# EAGLE schematic 2023 (EAGLE 9.6.2)
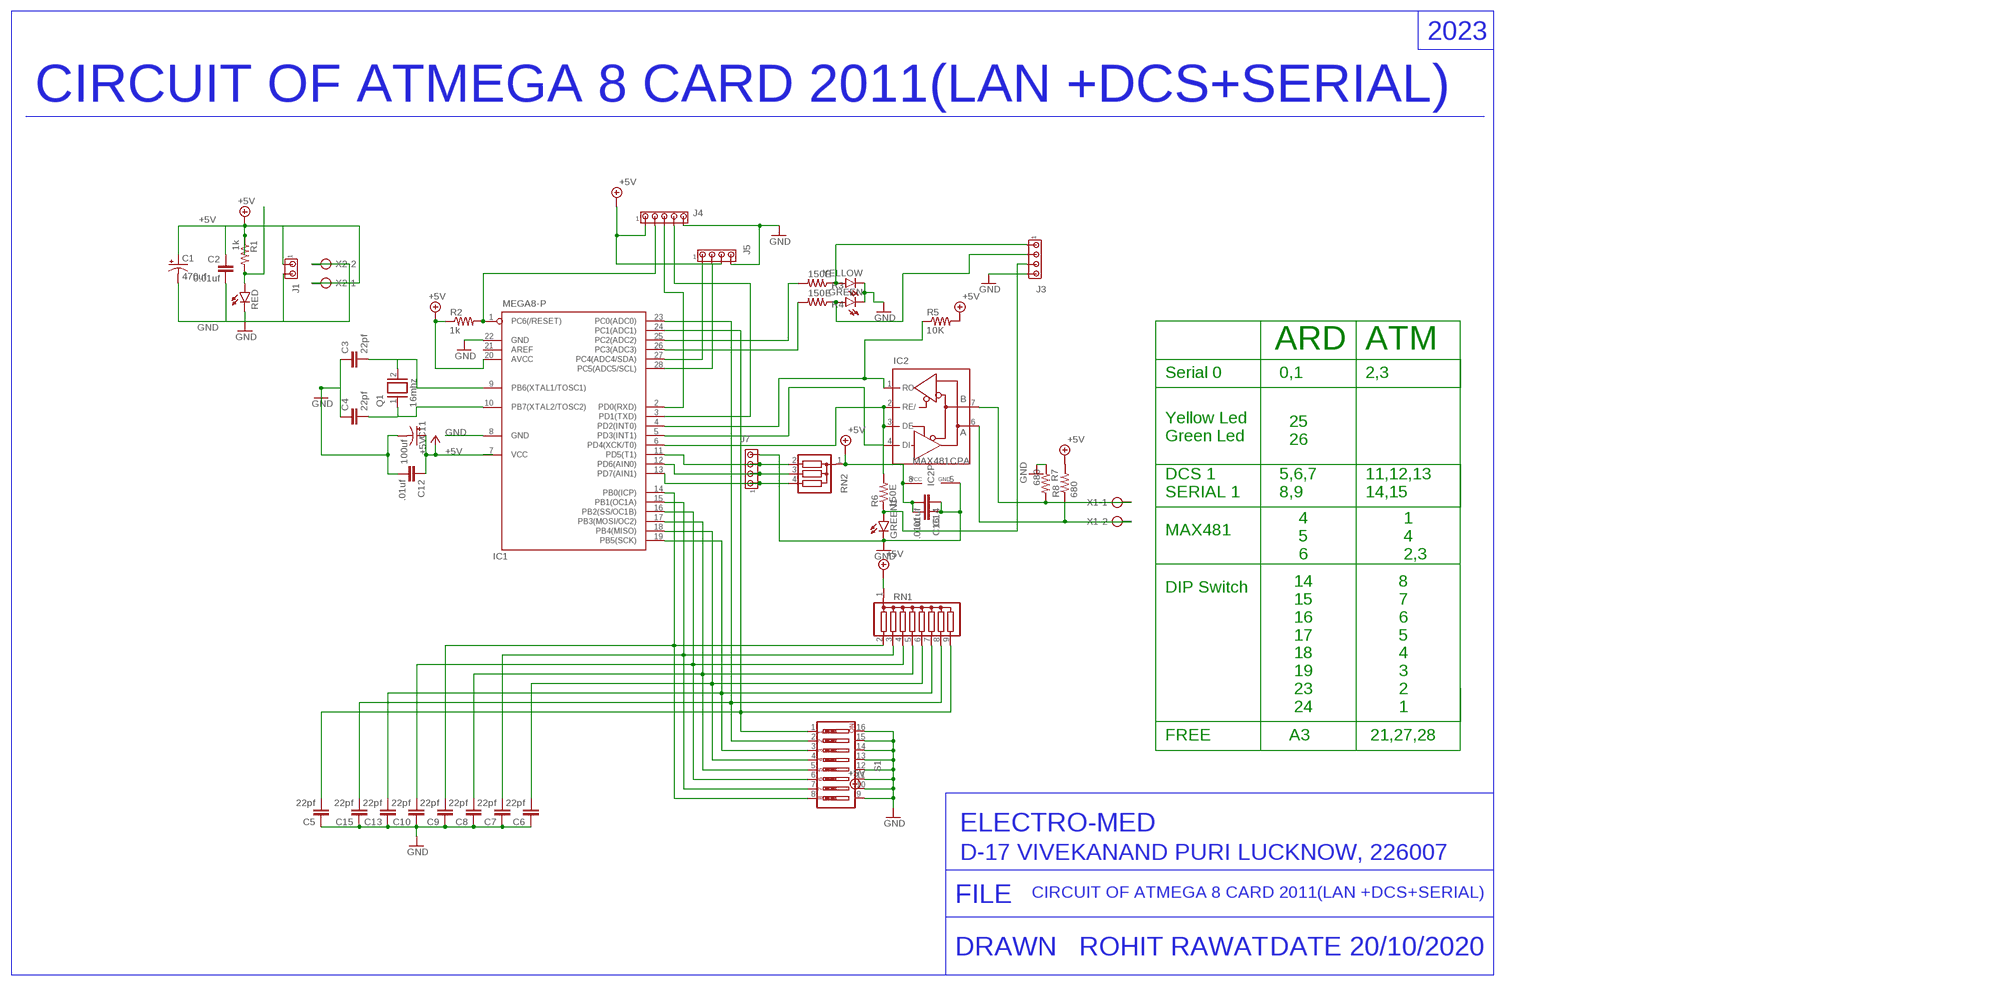
[diagram p0: schematic, sheet 1]

## Parts
C1  470uf  CPOL-USE5-10.5  [E5-10,5]
C2  0.01uf  C-EU-2050-030X075  [C050-030X075]
C3  22pf  C-EU-2050-030X075  [C050-030X075]
C4  22pf  C-EU-2050-030X075  [C050-030X075]
C5  22pf  C-EU-2050-030X075  [C050-030X075]
C6  22pf  C-EU-2050-030X075  [C050-030X075]
C7  22pf  C-EU-2050-030X075  [C050-030X075]
C8  22pf  C-EU-2050-030X075  [C050-030X075]
C9  22pf  C-EU-2050-030X075  [C050-030X075]
C10  22pf  C-EU-2050-030X075  [C050-030X075]
C11  100uf  CPOL-USE5-8.5  [E5-8,5]
C12  .01uf  C-EU050-025X075  [C050-025X075]
C13  22pf  C-EU-2050-030X075  [C050-030X075]
C14  .01uf  C-EU050-025X075  [C050-025X075]
C15  22pf  C-EU-2050-030X075  [C050-030X075]
C16  .01uf  C-EU050-025X075  [C050-025X075]
GREEN  LED5MM  [LED5MM]
GREEN1  LED5MM  [LED5MM]
IC1  MEGA8-P  [DIL28-3]
IC2  MAX481CPA  [DIL08]
J1  MTA02-100  [10X02MTA]
J3  MTA04-100  [10X04MTA]
J4  MTA05-100  [10X05MTA]
J5  MTA04-100  [10X04MTA]
J7  MTA04-100  [10X04MTA]
Q1  16mhz  XTAL/S  [QS]
R1  1k  R-US_0207/10  [0207/10]
R2  1k  R-US_0207/10  [0207/10]
R3  150E  R-US_0207/10  [0207/10]
R4  150E  R-US_0207/10  [0207/10]
R5  10K  R-US_0207/10  [0207/10]
R6  150E  R-US_0207/10  [0207/10]
R7  680  R-US_0207/10  [0207/10]
R8  680  R-US_0207/10  [0207/10]
RED  LED5MM  [LED5MM]
RN1  G08R  [SIL9]
RN2  G03R  [SIL4]
S1  SW_DIP-8  [EDG-08]
X1  AK300/2  [AK300/2]
X2  AK300/2  [AK300/2]
YELLOW  LED5MM  [LED5MM]

## Nets
+5V: C1.+ C2.1 C11.+ C12.1 C14.2 C16.2 IC1.7(VCC) IC1.20(AVCC) IC2.8(VCC) J1.1 J4.1 J5.3 R1.1 R2.1 R5.2 R8.2 RN1.1 RN2.1 X2.1
CRYSTAL: C4.2 IC1.10(PB7(XTAL2/TOSC2)) Q1.1
GND: C1.- C2.2 C3.1 C4.1 C5.1 C6.1 C7.1 C8.1 C9.1 C10.1 C11.- C12.2 C13.1 C14.1 C15.1 C16.1 GREEN1.K(C) GREEN.K(C) IC1.8(GND) IC1.22(GND) IC2.5(GND) J1.2 J3.4 J4.5 J5.4 J7.4 R7.1 RED.K(C) S1.9 S1.10 S1.11 S1.12 S1.13 S1.14 S1.15 S1.16 X2.2 YELLOW.K(C)
N$1: GREEN1.A J3.3 R6.1
N$2: IC1.6(PD4(XCK/T0)) IC2.2(RE/) IC2.3(DE) R6.2
N$3: C9.2 IC1.14(PB0(ICP)) RN1.2 S1.8
N$4: C7.2 IC1.15(PB1(OC1A)) RN1.3 S1.7
N$5: IC2.7(B) R7.2 X1.1
N$6: C3.2 IC1.9(PB6(XTAL1/TOSC1)) Q1.2
N$7: IC1.1(PC6(/RESET)) J4.2 R2.2
N$8: C10.2 IC1.16(PB2(SS/OC1B)) RN1.4 S1.6
N$9: IC2.6(A) R8.1 X1.2
N$10: IC1.4(PD2(INT0)) IC2.1(RO) R5.1
N$11: C8.2 IC1.17(PB3(MOSI/OC2)) RN1.5 S1.5
N$12: C6.2 IC1.18(PB4(MISO)) RN1.6 S1.4
N$13: IC1.2(PD0(RXD)) J4.3
N$14: IC1.5(PD3(INT1)) IC2.4(DI)
N$15: IC1.3(PD1(TXD)) J4.4
N$16: C15.2 IC1.23(PC0(ADC0)) RN1.8 S1.2
N$17: C13.2 IC1.19(PB5(SCK)) RN1.7 S1.3
N$18: IC1.27(PC4(ADC4/SDA)) J5.1
N$19: IC1.11(PD5(T1)) J7.3 RN2.2
N$20: IC1.12(PD6(AIN0)) J7.2 RN2.3
N$21: IC1.28(PC5(ADC5/SCL)) J5.2
N$23: R1.2 RED.A
N$24: J3.1 R3.1 YELLOW.A
N$25: GREEN.A J3.2 R4.1
N$26: IC1.26(PC3(ADC3)) R4.2
N$27: IC1.25(PC2(ADC2)) R3.2
N$28: IC1.13(PD7(AIN1)) J7.1 RN2.4
N$34: C5.2 IC1.24(PC1(ADC1)) RN1.9 S1.1
Unconnected: IC1.21(AREF)

## Notes on the sheet
- 2023
- CIRCUIT OF ATMEGA 8 CARD 2011(LAN +DCS+SERIAL)
- ARD | ATM
- Serial 0 | 0,1 | 2,3
- 25
  26
- Yellow Led
  Green Led
- DCS 1
  SERIAL 1
- 5,6,7
  8,9
- 11,12,13
  14,15
- MAX481
- 4
  5
  6
- 1
  4
  2,3
- DIP Switch
- 14
  15
  16
  17
  18
  19
  23
  24
- 8
  7
  6
  5
  4
  3
  2
  1
- FREE | A3 | 21,27,28
- D-17 VIVEKANAND PURI LUCKNOW, 226007 | ELECTRO-MED
- CIRCUIT OF ATMEGA 8 CARD 2011(LAN +DCS+SERIAL)
- FILE
- DRAWN   ROHIT RAWAT | DATE 20/10/2020

## Library data of the parts
C1 = EMemrcl:CPOL-US: POLARIZED CAPACITOR, American symbol; SPICEPREFIX: C
C2-C10 C13 C15 = em display-kingbright:C-EU-2: CAPACITOR, European symbol; SPICEPREFIX: C
C11 = rcl:CPOL-US: POLARIZED CAPACITOR, American symbol; SPICEPREFIX: C
C12 C14 C16 = emrcl:C-EU: CAPACITOR, European symbol; SPICEPREFIX: C
GREEN GREEN1 RED YELLOW = em led:LED: LED OSRAM: - CHIPLED LG R971, LG N971, LY N971, LG Q971, LY Q971, LO R971, LY R971 LH N974, LH R974 LS Q976, LO Q976, LY Q976 LO Q996 - Hyper CHIPLED LW Q18S LB Q993, LB Q99A, LB R99A - SideLED LS A670, LO A670, LY A670, LG A670, LP A670 LB A673, LV A673, LT A673, LW A673 LH A674 LY A675 LS A676, LA A676, LO A676, LY A676, LW A676 LS A679, LY A679, LG A679 - Hyper Micro SIDELED® LS Y876, LA Y876, LO Y876, LY Y876 LT Y87S - SmartLED LW L88C, LW L88S LB L89C, LB L89S, LG L890 LS L89K, LO L89K, LY L89K LS L896, LA L896, LO L896, LY L896 - TOPLED LS T670, LO T670, LY T670, LG T670, LP T670 LSG T670, LSP T670, LSY T670, LOP T670, LYG T670 LG T671, LOG T671, LSG T671 LB T673, LV T673, LT T673, LW T673 LH T674 LS T676, LA T676, LO T676, LY T676, LB T676, LH T676, LSB T676, LW T676 LB T67C, LV T67C, LT T67C, LS T67K, LO T67K, LY T67K, LW E67C LS E67B, LA E67B, LO E67B, LY E67B, LB E67C, LV E67C, LT E67C LW T67C LS T679, LY T679, LG T679 LS T770, LO T770, LY T770, LG T770, LP T770 LB T773, LV T773, LT T773, LW T773 LH T774 LS E675, LA E675, LY E675, LS T675 LS T776, LA T776, LO T776, LY T776, LB T776 LHGB T686 LT T68C, LB T68C - Hyper Mini TOPLED® LB M676 - Mini TOPLED Santana® LG M470 LS M47K, LO M47K, LY M47K Source: http://www.osram.convergy.de LUXEON: - LUMILED® LXK2-PW12-R00, LXK2-PW12-S00, LXK2-PW14-U00, LXK2-PW14-V00 LXK2-PM12-R00, LXK2-PM12-S00, LXK2-PM14-U00 LXK2-PE12-Q00, LXK2-PE12-R00, LXK2-PE12-S00, LXK2-PE14-T00, LXK2-PE14-U00 LXK2-PB12-K00, LXK2-PB12-L00, LXK2-PB12-M00, LXK2-PB14-N00, LXK2-PB14-P00, LXK2-PB14-Q00 LXK2-PR12-L00, LXK2-PR12-M00, LXK2-PR14-Q00, LXK2-PR14-R00 LXK2-PD12-Q00, LXK2-PD12-R00, LXK2-PD12-S00 LXK2-PH12-R00, LXK2-PH12-S00 LXK2-PL12-P00, LXK2-PL12-Q00, LXK2-PL12-R00 Source: www.luxeon.com KINGBRIGHT: KA-3528ASYC Source: www.kingbright.com
IC1 = ematmel:MEGA8-P: MICROCONTROLLER 8 Kbytes FLASH, 1 kbytes SRAM, 512 bytes EEPROM, USART, 4-channel 10 bit ADC, 2-channel 8 bit ADC Pin compatible with Atmega48, ATMega88, ATMega168 Source: avr.lbr; OC_FARNELL: unknown; OC_NEWARK: unknown
IC2 = maxim:MAX481CPA: RS485 TRANSEIVER; MPN: MAX481CPA+; OC_FARNELL: unknown; OC_NEWARK: 99K3445
J1 = em con-amp:MTA02-100: AMP connector; SPICEPREFIX: B
J3 J5 J7 = em display-kingbright:MTA04-100: AMP connector
J4 = con-amp:MTA05-100: AMP connector
Q1 = special:XTAL/S: CRYSTAL
R1-R8 = emrcl:R-US_: RESISTOR, American symbol; SPICEPREFIX: R
RN1 = resistor-sil:G08R: SIL RESISTOR; OC_FARNELL: unknown; OC_NEWARK: unknown
RN2 = resistor-sil:G03R: SIL RESISTOR; OC_FARNELL: unknown; OC_NEWARK: unknown
S1 = special:SW_DIP-8: DIP SWITCH
X1 = EMLcon-ptr500:AK300/2: CONNECTOR; OC_FARNELL: unknown; OC_NEWARK: unknown
X2 = em con-ptr500:AK300/2: CONNECTOR; OC_FARNELL: unknown; OC_NEWARK: unknown

## Net classes
0 default: clearance 0.25 mm